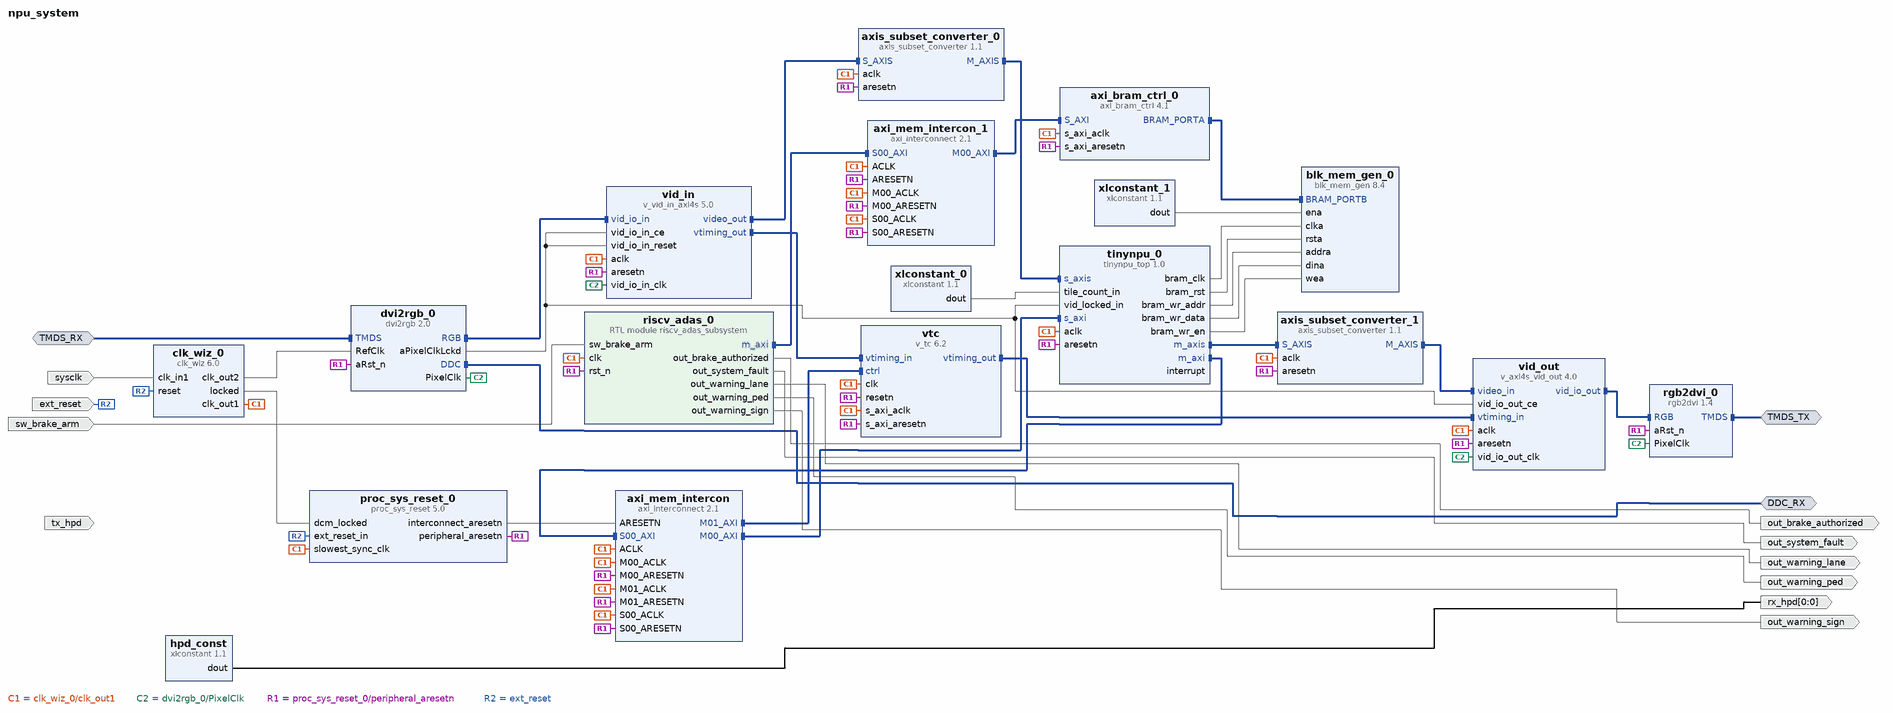
[diagram p0: block diagram of the top level]
# Vivado block design npu_system, xc7z020clg400-1, Vivado 2025.1
create_bd_design npu_system

create_bd_intf_port -mode Slave -vlnv digilentinc.com:interface:tmds_rtl:1.0 TMDS_RX
create_bd_intf_port -mode Master -vlnv digilentinc.com:interface:tmds_rtl:1.0 TMDS_TX
create_bd_intf_port -mode Master -vlnv xilinx.com:interface:iic_rtl:1.0 DDC_RX
create_bd_port -dir I sw_brake_arm
create_bd_port -dir I -type clk sysclk
set_property -dict {CONFIG.FREQ_HZ 125000000} [get_bd_ports sysclk]
create_bd_port -dir I -type rst ext_reset
set_property -dict {CONFIG.POLARITY ACTIVE_HIGH} [get_bd_ports ext_reset]
create_bd_port -dir O out_warning_ped
create_bd_port -dir O out_warning_lane
create_bd_port -dir O out_warning_sign
create_bd_port -dir O out_brake_authorized
create_bd_port -dir O out_system_fault
create_bd_port -dir I tx_hpd
create_bd_port -dir O -from 0 -to 0 -type data rx_hpd

create_bd_cell -type ip -vlnv HariharanGanesh:user:tinynpu_top:1.0 tinynpu_0
set_property -dict {CONFIG.SCALE_WIDTH 32} [get_bd_cells tinynpu_0]
create_bd_cell -type ip -vlnv digilentinc.com:ip:dvi2rgb:2.0 dvi2rgb_0
set_property -dict {CONFIG.kEmulateDDC true CONFIG.kRstActiveHigh false} [get_bd_cells dvi2rgb_0]
create_bd_cell -type ip -vlnv digilentinc.com:ip:rgb2dvi:1.4 rgb2dvi_0
set_property -dict {CONFIG.kRstActiveHigh false} [get_bd_cells rgb2dvi_0]
create_bd_cell -type ip -vlnv xilinx.com:ip:v_vid_in_axi4s:5.0 vid_in
set_property -dict {CONFIG.C_HAS_ASYNC_CLK 1 CONFIG.C_PIXELS_PER_CLOCK 1} [get_bd_cells vid_in]
create_bd_cell -type ip -vlnv xilinx.com:ip:v_axi4s_vid_out:4.0 vid_out
set_property -dict {CONFIG.C_HAS_ASYNC_CLK 1 CONFIG.C_PIXELS_PER_CLOCK 1} [get_bd_cells vid_out]
create_bd_cell -type ip -vlnv xilinx.com:ip:v_tc:6.2 vtc
set_property -dict {CONFIG.enable_detection true CONFIG.enable_generation true} [get_bd_cells vtc]
create_bd_cell -type ip -vlnv xilinx.com:ip:axi_interconnect:2.1 axi_mem_intercon
set_property -dict {CONFIG.M00_HAS_REGSLICE 4 CONFIG.NUM_MI 2 CONFIG.S00_HAS_REGSLICE 4} [get_bd_cells axi_mem_intercon]
create_bd_cell -type ip -vlnv xilinx.com:ip:clk_wiz:6.0 clk_wiz_0
set_property -dict [list \
  CONFIG.CLKOUT1_REQUESTED_OUT_FREQ 125.000 \
  CONFIG.CLKOUT2_REQUESTED_OUT_FREQ 200.000 \
  CONFIG.CLKOUT2_USED true \
  CONFIG.PRIM_IN_FREQ 125.000 \
] [get_bd_cells clk_wiz_0]
create_bd_cell -type ip -vlnv xilinx.com:ip:proc_sys_reset:5.0 proc_sys_reset_0
create_bd_cell -type module -reference riscv_adas_subsystem riscv_adas_0
create_bd_cell -type ip -vlnv xilinx.com:ip:axis_subset_converter:1.1 axis_subset_converter_0
set_property -dict [list \
  CONFIG.M_HAS_TKEEP 0 \
  CONFIG.M_HAS_TLAST 1 \
  CONFIG.M_HAS_TREADY 1 \
  CONFIG.M_HAS_TSTRB 0 \
  CONFIG.M_TDATA_NUM_BYTES 3 \
  CONFIG.M_TDEST_WIDTH 0 \
  CONFIG.M_TID_WIDTH 0 \
  CONFIG.M_TUSER_WIDTH 1 \
  CONFIG.S_HAS_TKEEP 0 \
  CONFIG.S_HAS_TLAST 1 \
  CONFIG.S_HAS_TREADY 1 \
  CONFIG.S_HAS_TSTRB 0 \
  CONFIG.S_TDATA_NUM_BYTES 3 \
  CONFIG.S_TDEST_WIDTH 0 \
  CONFIG.S_TID_WIDTH 0 \
  CONFIG.S_TUSER_WIDTH 1 \
] [get_bd_cells axis_subset_converter_0]
create_bd_cell -type ip -vlnv xilinx.com:ip:axis_subset_converter:1.1 axis_subset_converter_1
set_property -dict [list \
  CONFIG.M_HAS_TKEEP 0 \
  CONFIG.M_HAS_TLAST 1 \
  CONFIG.M_HAS_TREADY 1 \
  CONFIG.M_HAS_TSTRB 0 \
  CONFIG.M_TDATA_NUM_BYTES 4 \
  CONFIG.M_TDEST_WIDTH 0 \
  CONFIG.M_TID_WIDTH 0 \
  CONFIG.M_TUSER_WIDTH 0 \
  CONFIG.S_HAS_TKEEP 0 \
  CONFIG.S_HAS_TLAST 1 \
  CONFIG.S_HAS_TREADY 1 \
  CONFIG.S_HAS_TSTRB 0 \
  CONFIG.S_TDATA_NUM_BYTES 4 \
  CONFIG.S_TDEST_WIDTH 0 \
  CONFIG.S_TID_WIDTH 0 \
  CONFIG.S_TUSER_WIDTH 0 \
] [get_bd_cells axis_subset_converter_1]
create_bd_cell -type ip -vlnv xilinx.com:ip:xlconstant:1.1 xlconstant_0
set_property -dict {CONFIG.CONST_VAL 1 CONFIG.CONST_WIDTH 32} [get_bd_cells xlconstant_0]
create_bd_cell -type ip -vlnv xilinx.com:ip:xlconstant:1.1 hpd_const
set_property -dict {CONFIG.CONST_VAL 1} [get_bd_cells hpd_const]
create_bd_cell -type ip -vlnv xilinx.com:ip:axi_bram_ctrl:4.1 axi_bram_ctrl_0
set_property -dict {CONFIG.DATA_WIDTH 128 CONFIG.SINGLE_PORT_BRAM 1} [get_bd_cells axi_bram_ctrl_0]
create_bd_cell -type ip -vlnv xilinx.com:ip:blk_mem_gen:8.4 blk_mem_gen_0
set_property -dict [list \
  CONFIG.Enable_B Use_ENB_Pin \
  CONFIG.Memory_Type True_Dual_Port_RAM \
  CONFIG.Port_B_Clock 100 \
  CONFIG.Port_B_Enable_Rate 100 \
  CONFIG.Port_B_Write_Rate 0 \
  CONFIG.Read_Width_A 128 \
  CONFIG.Use_RSTB_Pin true \
  CONFIG.Write_Width_A 128 \
] [get_bd_cells blk_mem_gen_0]
create_bd_cell -type ip -vlnv xilinx.com:ip:axi_interconnect:2.1 axi_mem_intercon_1
set_property -dict {CONFIG.NUM_MI 1} [get_bd_cells axi_mem_intercon_1]
create_bd_cell -type ip -vlnv xilinx.com:ip:xlconstant:1.1 xlconstant_1
set_property -dict {CONFIG.CONST_VAL 1} [get_bd_cells xlconstant_1]

# ---- connections ----

connect_bd_intf_net -intf_net TMDS_0_1 [get_bd_intf_ports TMDS_RX] [get_bd_intf_pins dvi2rgb_0/TMDS]
connect_bd_intf_net [get_bd_intf_pins axi_bram_ctrl_0/BRAM_PORTA] [get_bd_intf_pins blk_mem_gen_0/BRAM_PORTB]
connect_bd_intf_net [get_bd_intf_pins axi_mem_intercon_1/M00_AXI] [get_bd_intf_pins axi_bram_ctrl_0/S_AXI]
connect_bd_intf_net [get_bd_intf_pins axi_mem_intercon/M00_AXI] [get_bd_intf_pins tinynpu_0/s_axi]
connect_bd_intf_net [get_bd_intf_pins axi_mem_intercon/M01_AXI] [get_bd_intf_pins vtc/ctrl]
connect_bd_intf_net [get_bd_intf_pins axis_subset_converter_0/M_AXIS] [get_bd_intf_pins tinynpu_0/s_axis]
connect_bd_intf_net [get_bd_intf_ports DDC_RX] [get_bd_intf_pins dvi2rgb_0/DDC]
connect_bd_intf_net [get_bd_intf_pins dvi2rgb_0/RGB] [get_bd_intf_pins vid_in/vid_io_in]
connect_bd_intf_net [get_bd_intf_ports TMDS_TX] [get_bd_intf_pins rgb2dvi_0/TMDS]
connect_bd_intf_net [get_bd_intf_pins riscv_adas_0/m_axi] [get_bd_intf_pins axi_mem_intercon_1/S00_AXI]
connect_bd_intf_net [get_bd_intf_pins tinynpu_0/m_axi] [get_bd_intf_pins axi_mem_intercon/S00_AXI]
connect_bd_intf_net -intf_net tinynpu_0_m_axis [get_bd_intf_pins axis_subset_converter_1/M_AXIS] [get_bd_intf_pins vid_out/video_in]
connect_bd_intf_net [get_bd_intf_pins tinynpu_0/m_axis] [get_bd_intf_pins axis_subset_converter_1/S_AXIS]
connect_bd_intf_net [get_bd_intf_pins vid_in/video_out] [get_bd_intf_pins axis_subset_converter_0/S_AXIS]
connect_bd_intf_net [get_bd_intf_pins vid_in/vtiming_out] [get_bd_intf_pins vtc/vtiming_in]
connect_bd_intf_net [get_bd_intf_pins vid_out/vid_io_out] [get_bd_intf_pins rgb2dvi_0/RGB]
connect_bd_intf_net [get_bd_intf_pins vtc/vtiming_out] [get_bd_intf_pins vid_out/vtiming_in]
connect_bd_net -net clk_in1_0_1 [get_bd_ports sysclk] [get_bd_pins clk_wiz_0/clk_in1]
connect_bd_net [get_bd_pins clk_wiz_0/clk_out1] \
  [get_bd_pins proc_sys_reset_0/slowest_sync_clk] [get_bd_pins vid_in/aclk] [get_bd_pins vid_out/aclk] \
  [get_bd_pins vtc/s_axi_aclk] [get_bd_pins vtc/clk] [get_bd_pins axis_subset_converter_0/aclk] \
  [get_bd_pins axis_subset_converter_1/aclk] [get_bd_pins riscv_adas_0/clk] [get_bd_pins axi_bram_ctrl_0/s_axi_aclk] \
  [get_bd_pins tinynpu_0/aclk] [get_bd_pins axi_mem_intercon/ACLK] [get_bd_pins axi_mem_intercon/S00_ACLK] \
  [get_bd_pins axi_mem_intercon/M00_ACLK] [get_bd_pins axi_mem_intercon/M01_ACLK] [get_bd_pins axi_mem_intercon_1/ACLK] \
  [get_bd_pins axi_mem_intercon_1/S00_ACLK] [get_bd_pins axi_mem_intercon_1/M00_ACLK]
connect_bd_net [get_bd_pins clk_wiz_0/locked] [get_bd_pins proc_sys_reset_0/dcm_locked]
connect_bd_net [get_bd_pins dvi2rgb_0/PixelClk] \
  [get_bd_pins vid_in/vid_io_in_clk] [get_bd_pins vid_out/vid_io_out_clk] [get_bd_pins rgb2dvi_0/PixelClk]
connect_bd_net [get_bd_pins dvi2rgb_0/aPixelClkLckd] \
  [get_bd_pins vid_in/vid_io_in_ce] [get_bd_pins vid_in/vid_io_in_reset] [get_bd_pins vid_out/vid_io_out_ce] \
  [get_bd_pins tinynpu_0/vid_locked_in]
connect_bd_net [get_bd_pins hpd_const/dout] [get_bd_ports rx_hpd]
connect_bd_net [get_bd_pins proc_sys_reset_0/interconnect_aresetn] [get_bd_pins axi_mem_intercon/ARESETN]
connect_bd_net -net ps7_FCLK_CLK1 [get_bd_pins clk_wiz_0/clk_out2] [get_bd_pins dvi2rgb_0/RefClk]
connect_bd_net -net ps7_FCLK_RESET0_N [get_bd_pins proc_sys_reset_0/peripheral_aresetn] \
  [get_bd_pins vtc/resetn] [get_bd_pins vtc/s_axi_aresetn] [get_bd_pins axis_subset_converter_0/aresetn] \
  [get_bd_pins axis_subset_converter_1/aresetn] [get_bd_pins vid_in/aresetn] [get_bd_pins vid_out/aresetn] \
  [get_bd_pins dvi2rgb_0/aRst_n] [get_bd_pins rgb2dvi_0/aRst_n] [get_bd_pins riscv_adas_0/rst_n] \
  [get_bd_pins axi_bram_ctrl_0/s_axi_aresetn] [get_bd_pins tinynpu_0/aresetn] [get_bd_pins axi_mem_intercon/S00_ARESETN] \
  [get_bd_pins axi_mem_intercon/M00_ARESETN] [get_bd_pins axi_mem_intercon/M01_ARESETN] \
  [get_bd_pins axi_mem_intercon_1/ARESETN] [get_bd_pins axi_mem_intercon_1/S00_ARESETN] \
  [get_bd_pins axi_mem_intercon_1/M00_ARESETN]
connect_bd_net -net reset_0_1 [get_bd_ports ext_reset] [get_bd_pins clk_wiz_0/reset] [get_bd_pins proc_sys_reset_0/ext_reset_in]
connect_bd_net [get_bd_pins riscv_adas_0/out_brake_authorized] [get_bd_ports out_brake_authorized]
connect_bd_net [get_bd_pins riscv_adas_0/out_system_fault] [get_bd_ports out_system_fault]
connect_bd_net [get_bd_pins riscv_adas_0/out_warning_lane] [get_bd_ports out_warning_lane]
connect_bd_net [get_bd_pins riscv_adas_0/out_warning_ped] [get_bd_ports out_warning_ped]
connect_bd_net [get_bd_pins riscv_adas_0/out_warning_sign] [get_bd_ports out_warning_sign]
connect_bd_net -net sw_brake_arm_0_1 [get_bd_ports sw_brake_arm] [get_bd_pins riscv_adas_0/sw_brake_arm]
connect_bd_net [get_bd_pins tinynpu_0/bram_clk] [get_bd_pins blk_mem_gen_0/clka]
connect_bd_net [get_bd_pins tinynpu_0/bram_rst] [get_bd_pins blk_mem_gen_0/rsta]
connect_bd_net [get_bd_pins tinynpu_0/bram_wr_addr] [get_bd_pins blk_mem_gen_0/addra]
connect_bd_net [get_bd_pins tinynpu_0/bram_wr_data] [get_bd_pins blk_mem_gen_0/dina]
connect_bd_net [get_bd_pins tinynpu_0/bram_wr_en] [get_bd_pins blk_mem_gen_0/wea]
# net tinynpu_0_interrupt has one end: tinynpu_0/interrupt
connect_bd_net [get_bd_pins xlconstant_0/dout] [get_bd_pins tinynpu_0/tile_count_in]
connect_bd_net [get_bd_pins xlconstant_1/dout] [get_bd_pins blk_mem_gen_0/ena]

# ---- address map ----
assign_bd_address -offset 0xC0000000 -range 16K -target_address_space [get_bd_addr_spaces riscv_adas_0/m_axi] [get_bd_addr_segs axi_bram_ctrl_0/S_AXI/Mem0]
assign_bd_address -offset 0x44A00000 -range 64K -target_address_space [get_bd_addr_spaces tinynpu_0/m_axi] [get_bd_addr_segs vtc/ctrl/Reg]
assign_bd_address -offset 0x80000000 -range 2G -target_address_space [get_bd_addr_spaces tinynpu_0/m_axi] [get_bd_addr_segs tinynpu_0/s_axi/reg0]

validate_bd_design
save_bd_design
